# Altium schematic sheet MainBoard_MCU_Power.SchDoc
size B
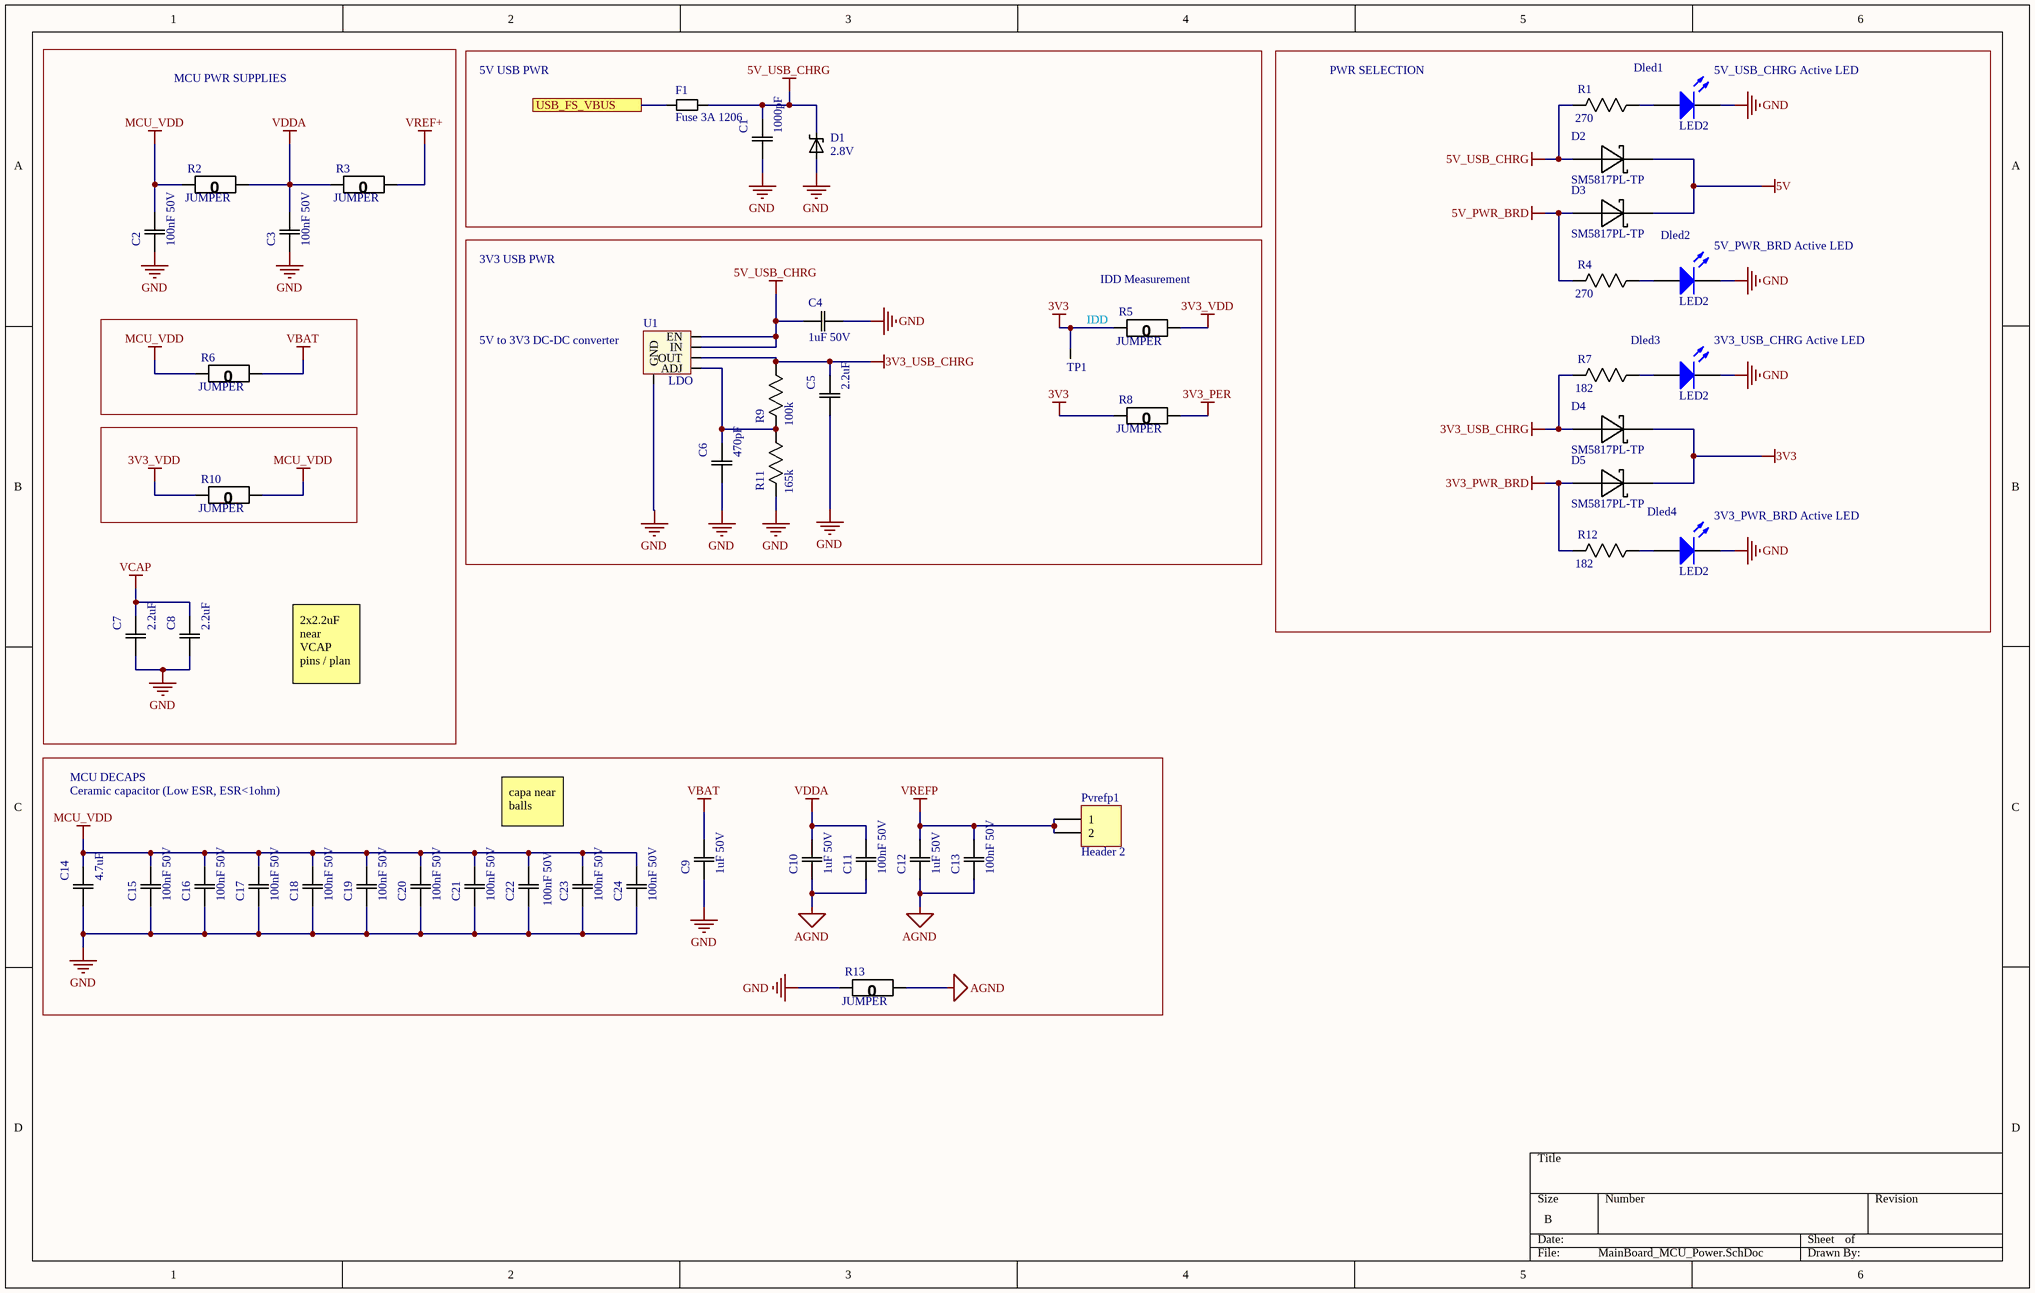
[diagram p0: MainBoard_MCU_Power.SchDoc]

## Parts
C1  1000pF  [0805]
C2  100nF 50V  [0805]
C3  100nF 50V  [0805]
C4  1uF 50V  [0805]
C5  2.2uF  [0805]
C6  470pF  [0805]
C7  2.2uF  [0805]
C8  2.2uF  [0805]
C9  1uF 50V  [0805]
C10  1uF 50V  [0805]
C11  100nF 50V  [0805]
C12  1uF 50V  [0805]
C13  100nF 50V  [0805]
C14  4.7uF  [0805]
C15  100nF 50V  [0805]
C16  100nF 50V  [0805]
C17  100nF 50V  [0805]
C18  100nF 50V  [0805]
C19  100nF 50V  [0805]
C20  100nF 50V  [0805]
C21  100nF 50V  [0805]
C22  100nF 50V  [0805]
C23  100nF 50V  [0805]
C24  100nF 50V  [0805]
D1  2.8V  [SOD-123]
D2  SM5817PL-TP  [SOD-123]
D3  SM5817PL-TP  [SOD-123]
D4  SM5817PL-TP  [SOD-123]
D5  SM5817PL-TP  [SOD-123]
Dled1  LED2  [3.2X1.6X1.1]
Dled2  LED2  [3.2X1.6X1.1]
Dled3  LED2  [3.2X1.6X1.1]
Dled4  LED2  [3.2X1.6X1.1]
F1  Fuse 3A 1206  [1206]
Pvrefp1  Header 2  [HDR1X2]
R1  270  [0805]
R2  JUMPER  [0805]
R3  JUMPER  [0805]
R4  270  [0805]
R5  JUMPER  [0805]
R6  JUMPER  [0805]
R7  182  [0805]
R8  JUMPER  [0805]
R9  100k  [0805]
R10  JUMPER  [0805]
R11  165k  [0805]
R12  182  [0805]
R13  JUMPER  [0805]
TP1  Test Point (Via)  [TP]  (value not drawn)
U1  LDO  [REG LIN POS ADJ 500MA 8SOIC]

## Blocks framed on the sheet
MCU PWR SUPPLIES: C2 C3 C7 C8 R2 R3 R6 R10
5V USB PWR: C1 D1 F1

## Ports
USB_FS_VBUS

## Nets
3V3: D4.C(K) D5.C(K) R5.2(R2) R8.2(R2) TP1.1
3V3_PER: R8.1(R1)
3V3_PWR_BRD: D5.A R12.2(R2)
3V3_USB_CHRG: C5.2(C2) D4.A R7.2(R2) R9.1(R1) U1.OUT
3V3_VDD: R5.1(R1) R10.2(R2)
5V: D2.C(K) D3.C(K)
5V_PWR_BRD: D3.A R4.2(R2)
5V_USB_CHRG: C1.2(C2) C4.1(C1) D1.C D2.A F1.2 R1.2(R2) U1.EN U1.IN
AGND: C10.1(C1) C11.1(C1) C12.1(C1) C13.1(C1) R13.1(R1)
GND: C1.1(C1) C2.1(C1) C3.1(C1) C4.2(C2) C5.1(C1) C6.1(C1) C7.1(C1) C8.1(C1) C9.1(C1) C14.1(C1) C15.1(C1) C16.1(C1) C17.1(C1) C18.1(C1) C19.1(C1) C20.1(C1) C21.1(C1) C22.1(C1) C23.1(C1) C24.1(C1) D1.A Dled1.2(K) Dled2.2(K) Dled3.2(K) Dled4.2(K) R11.2(R2) R13.2(R2) U1.GND
MCU_VDD: C2.2(C2) C14.2(C2) C15.2(C2) C16.2(C2) C17.2(C2) C18.2(C2) C19.2(C2) C20.2(C2) C21.2(C2) C22.2(C2) C23.2(C2) C24.2(C2) R2.2(R2) R6.2(R2) R10.1(R1)
VBAT: C9.2(C2) R6.1(R1)
VCAP: C7.2(C2) C8.2(C2)
VDDA: C3.2(C2) C10.2(C2) C11.2(C2) R2.1(R1) R3.2(R2)
VREF+: R3.1(R1)
VREFP: C12.2(C2) C13.2(C2) Pvrefp1.1 Pvrefp1.2
USB_FS_VBUS: F1.1 ; port USB_FS_VBUS
NetC6_2: C6.2(C2) R9.2(R2) R11.1(R1) U1.ADJ
NetDled1_1: Dled1.1(A) R1.1(R1)
NetDled2_1: Dled2.1(A) R4.1(R1)
NetDled3_1: Dled3.1(A) R7.1(R1)
NetDled4_1: Dled4.1(A) R12.1(R1)

## Notes on the sheet
- PWR SELECTION
- (near Dled1) 5V_USB_CHRG Active LED
- 3V3 USB PWR
- (near R5) IDD Measurement
- (near Dled2) 5V_PWR_BRD Active LED
- (near U1) 5V to 3V3 DC-DC converter
- IDD
- (near Dled3) 3V3_USB_CHRG Active LED
- (near Dled4) 3V3_PWR_BRD Active LED
- 2x2.2uF near VCAP pins / plan
- MCU DECAPS
- Ceramic capacitor (Low ESR, ESR<1ohm)
- capa near balls

## Library data of the parts
C1 = CAP 1000pF 50V: CAP CER 1000PF 50V X7R 0603/0805; Tolerance: 10%; Package: 0603/0805; Value: 1000pF; Rating: 50V; Temperature Coefficient: X7R; Operating Temperature: -55°C ~ 125°C
C2 C3 C11 C13 C15-C24 = CAP 100nF 50V: CAP CER 0.1UF 50V X7R 0805; Tolerance: 10%; Package: 0805; Value: 100nF; Rating: 50V
C4 C9 C10 C12 = CAP 1uF 50V: CAP CER 1UF 50V X7R 0805; Tolerance: 10%; Package: 0805; Value: 1uF; Rating: 50V; Temperature Coefficient: X7R; Operating Temperature: -55°C ~ 125°C
C5 C7 C8 = CAP 2.2uF 35V: CAP CER 2.2UF 35V X7R 0603/0805; Tolerance: 10%; Package: 0603/0805; Value: 2.2uF; Rating: 35V; Temperature Coefficient: X7R; Operating Temperature: -55°C ~ 125°C
C6 = CAP 470pF 50V: CAP CER 470PF 50V X7R 0603/0805; Tolerance: 10%; Package: 0603/0805; Value: 470pF; Rating: 50V; Temperature Coefficient: X7R; Operating Temperature: -55°C ~ 125°C
C14 = CAP 4.7uF 35V: CAP CER 4.7UF 35V X7R 0603/0805; Tolerance: 10%; Package: 0603/0805; Value: 4.7uF; Rating: 35V; Temperature Coefficient: X7R; Operating Temperature: -55°C ~ 125°C
D1 = DIODE ZENER 2.8V 500mW: Zener Diode 2.8V 500mW ±5% Surface Mount SOD-123; Impedance (Max) (Zzt): 30 Ohms; Current - Reverse Leakage @ Vr: 75µA @ 1V; Voltage - Forward (Vf) (Max) @ If: 900mV @ 10mA; ComponentLink1Description: digikey; ComponentLink1URL: https://www.digikey.ca/en/products/detail/micro-commercial-co/MMSZ5245B-TP/1793206; Power - Max: 500mW; Voltage - Zener (Nom) (Vz): 2.8V
D2-D5 = DIODE SCHOTTKY 20V 1A: Diode Schottky 20V 1A Surface Mount SOD-123FL; MF: Micro Commercial Co; ComponentLink1Description: digikey; ComponentLink1URL: https://www.digikey.ca/product-detail/en/on-semiconductor/MBR0540T1G/MBR0540T1GOSCT-ND/917967; Digikey: SM5817PL-TPMSCT-ND; Digikey Link: https://www.digikey.ca/product-detail/en/micro-commercial-co/SM5817PL-TP/SM5817PL-TPMSCT-ND/1793410; MP: SM5817PL-TP; Voltage Rating: 20V; Package: SOD-123; Current Rating: 1A
Dled1-Dled4 = LED GREEN SMD: Typical RED, GREEN, YELLOW, AMBER GaAs LED; Voltage - Forward (Vf) (Typ): 2V; Lens Transparency: Clear; Current - Test: 20mA; Package: 1206; Color: Green
F1 = FUSE 3A 63V SLOW: FUSE 3A 63V AC/DC SLOW 1206; Response Time: Slow Blow; Current Rating (Amps): 3A; Operating Temperature: -55°C ~ 90°C; Voltage Rating - AC: 63V; Voltage Rating - DC: 63V
Pvrefp1 = Header 2: Header, 2-Pin; LatestRevisionDate: 17-Jul-2002; LatestRevisionNote: Re-released for DXP Platform.; Publisher: Altium Limited
R1 R4 = RES 270.0 1/8W: RES SMD 270 OHM 5% 1/8W 0805; Power (Watts): 0.125W; Package: 0805; Value: 270; Tolerance: 5%
R2 R3 R5 R6 R8 R10 R13 = RES 0 JUMPER: RES SMD 0 OHM JUMPER GENERIC 0805; Value: 0; Package: 0805
R7 R12 = RES 182.0 1/8W: RES SMD 182 OHM 1% 1/8W 0805; Power (Watts): 0.125W; Package: 0805; Value: 182; Tolerance: 1%
R9 = RES 100k 1/8W - 5%: RES SMD 100K OHM 5% 1/8W 0805; Power (Watts): 0.125W; Package: 0805; Value: 100k; Tolerance: 5%
R11 = RES 165k 1/4W: RES SMD 165K OHM 1% 1/4W 0805; Power (Watts): 0.25W; Package: 0805; Value: 165k; Tolerance: 1%
U1 = REG LIN POS ADJ: Linear Voltage Regulator IC  1 Output  500mA 8-SOIC; MF: Texas Instruments; MP: TL5209DR; Digikey: 296-21569-1-ND; Digikey Link: https://www.digikey.ca/product-detail/en/texas-instruments/TL5209DR/296-21569-1-ND/1427137; Price: 1.548 CAD; Rating: 500mA; Package: 8 SOIC; Supplier 1: Digi-Key; Supplier Part Number 1: 296-21569-1-ND